# Altium schematic sheet Bluetooth.SchDoc
size A4
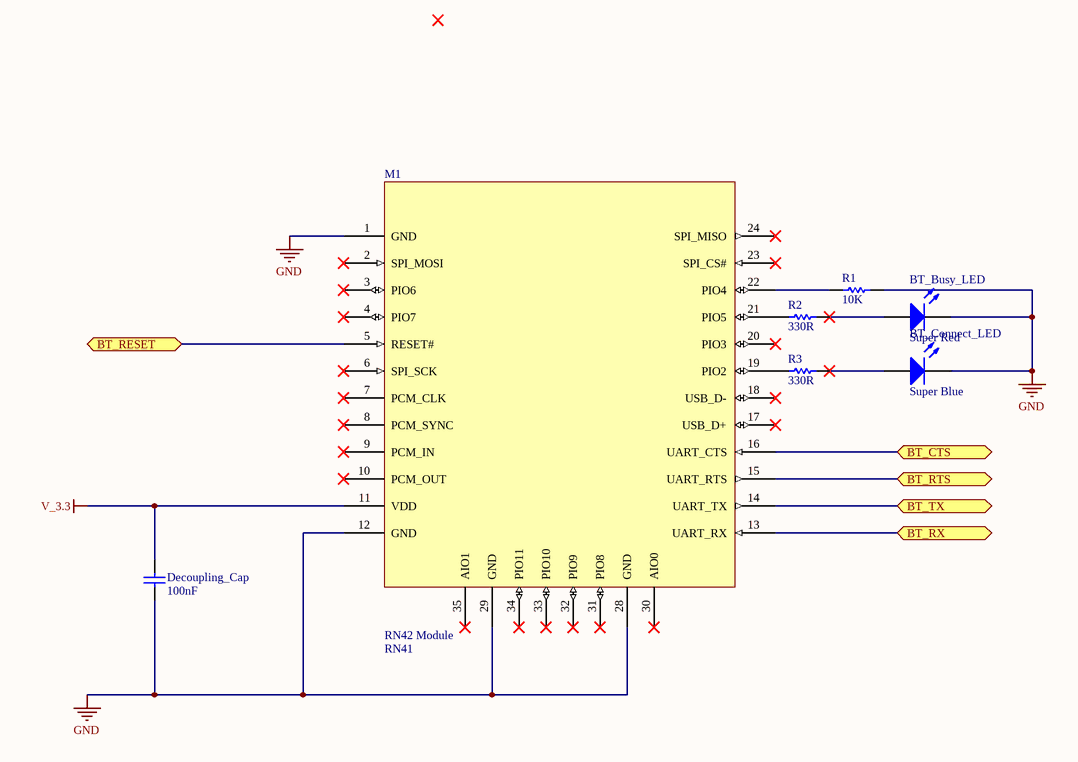
[diagram p0: Bluetooth.SchDoc]

## Parts
BT_Busy_LED  Super Red  [LED0805]
BT_Connect_LED  Super Blue  [LED0805]
Decoupling_Cap  100nF  [CC0603]
M1  RN42 Module  value RN41  [RN42-LAND]  (no BOM)
R1  10K  [R0603]
R2  330R  [R0603]
R3  330R  [R0603]

## Ports
BT_CTS, BT_RESET, BT_RTS, BT_RX, BT_TX

## Nets
GND: BT_Busy_LED.2(K) BT_Connect_LED.2(K) Decoupling_Cap.2 M1.1(GND) M1.12(GND) M1.28(GND) M1.29(GND) R1.2
V_3.3: Decoupling_Cap.1 M1.11(VDD)
BT_CTS: M1.16(UART_CTS) ; port BT_CTS
BT_RESET: M1.5(RESET#) ; port BT_RESET
BT_RTS: M1.15(UART_RTS) ; port BT_RTS
BT_RX: M1.13(UART_RX) ; port BT_RX
BT_TX: M1.14(UART_TX) ; port BT_TX
NetBT_Busy_LED_1: BT_Busy_LED.1(A) R2.2
NetBT_Connect_LED_1: BT_Connect_LED.1(A) R3.2
NetM1_19: M1.19(PIO2) R3.1
NetM1_21: M1.21(PIO5) R2.1
NetM1_22: M1.22(PIO4) R1.1

Not connected (* = marked no-connect by the designer): M1 2(SPI_MOSI)* 3(PIO6)* 4(PIO7)* 6(SPI_SCK)* 7(PCM_CLK)* 8(PCM_SYNC)* 9(PCM_IN)* 10(PCM_OUT)* 17(USB_D+)* 18(USB_D-)* 20(PIO3)* 23(SPI_CS#)* 24(SPI_MISO)* 30(AIO0)* 31(PIO8)* 32(PIO9)* 33(PIO10)* 34(PIO11)* 35(AIO1)*

## Library data of the parts
BT_Busy_LED = LED0805_S_RED: LED 0805 Super Red; component_type: Opto; ECE_Component_Code: LED0805_S_RED; Supplier_Component_Code: ZD-P023; published: 12/03/2007 11:34:37 a.m.; Supplier_Name: Soanar Plus; price: 0.43; value: Super Red; Part Number: LED0805_S_RED; Component Kind: Standard; Component Type: Standard; Designator: LED0805_S_RED; Pin Count: 2
BT_Connect_LED = LED0805_S_BLUE: LED 0805 Super Blue; component_type: Opto; ECE_Component_Code: LED0805_S_BLUE; Supplier_Component_Code: ZD-P030; published: 12/03/2007 11:34:37 a.m.; Supplier_Name: Soanar Plus; price: 1.91; value: Super Blue; Part Number: LED0805_S_BLUE; Component Kind: Standard; Component Type: Standard; Designator: LED0805_S_BLUE; Pin Count: 2
Decoupling_Cap = 100nF_CC0603: 0603 Capacitor; Supplier_Component_Code: RC-P100; published: 28/03/2007 10:54:57 a.m.; Supplier_Name: Soanar Plus; price: 0.09; value: 100nF; Part Number: 100nF_CC0603; Component Kind: Standard; Component Type: Standard; Designator: 100nF_CC0603; Pin Count: 2
M1 = RN42MOD: Supplier 1: Sparkfun; Supplier part number: WRL-08497
R1 = 10K_R0603: 0603 Resistor; ECE_Component_Code: 10K_R0603; value: 10K; Supplier_Component_Code: RS-S097; published: 12/03/2007 11:34:34 a.m.; Supplier_Name: Soanar Plus; price: 0.08; Part Number: 10K_R0603; Component Kind: Standard; Component Type: Standard; Designator: 10K_R0603; Pin Count: 2
R2 R3 = 330R_R0603: 0603 Resistor; ECE_Component_Code: 330R_R0603; value: 330R; Supplier_Component_Code: RS-S061; published: 12/03/2007 11:34:34 a.m.; Supplier_Name: Soanar Plus; price: 0.08; Part Number: 330R_R0603; Component Kind: Standard; Component Type: Standard; Designator: 330R_R0603; Pin Count: 2